# EAGLE design PCB-dol (EAGLE 9.6.2)
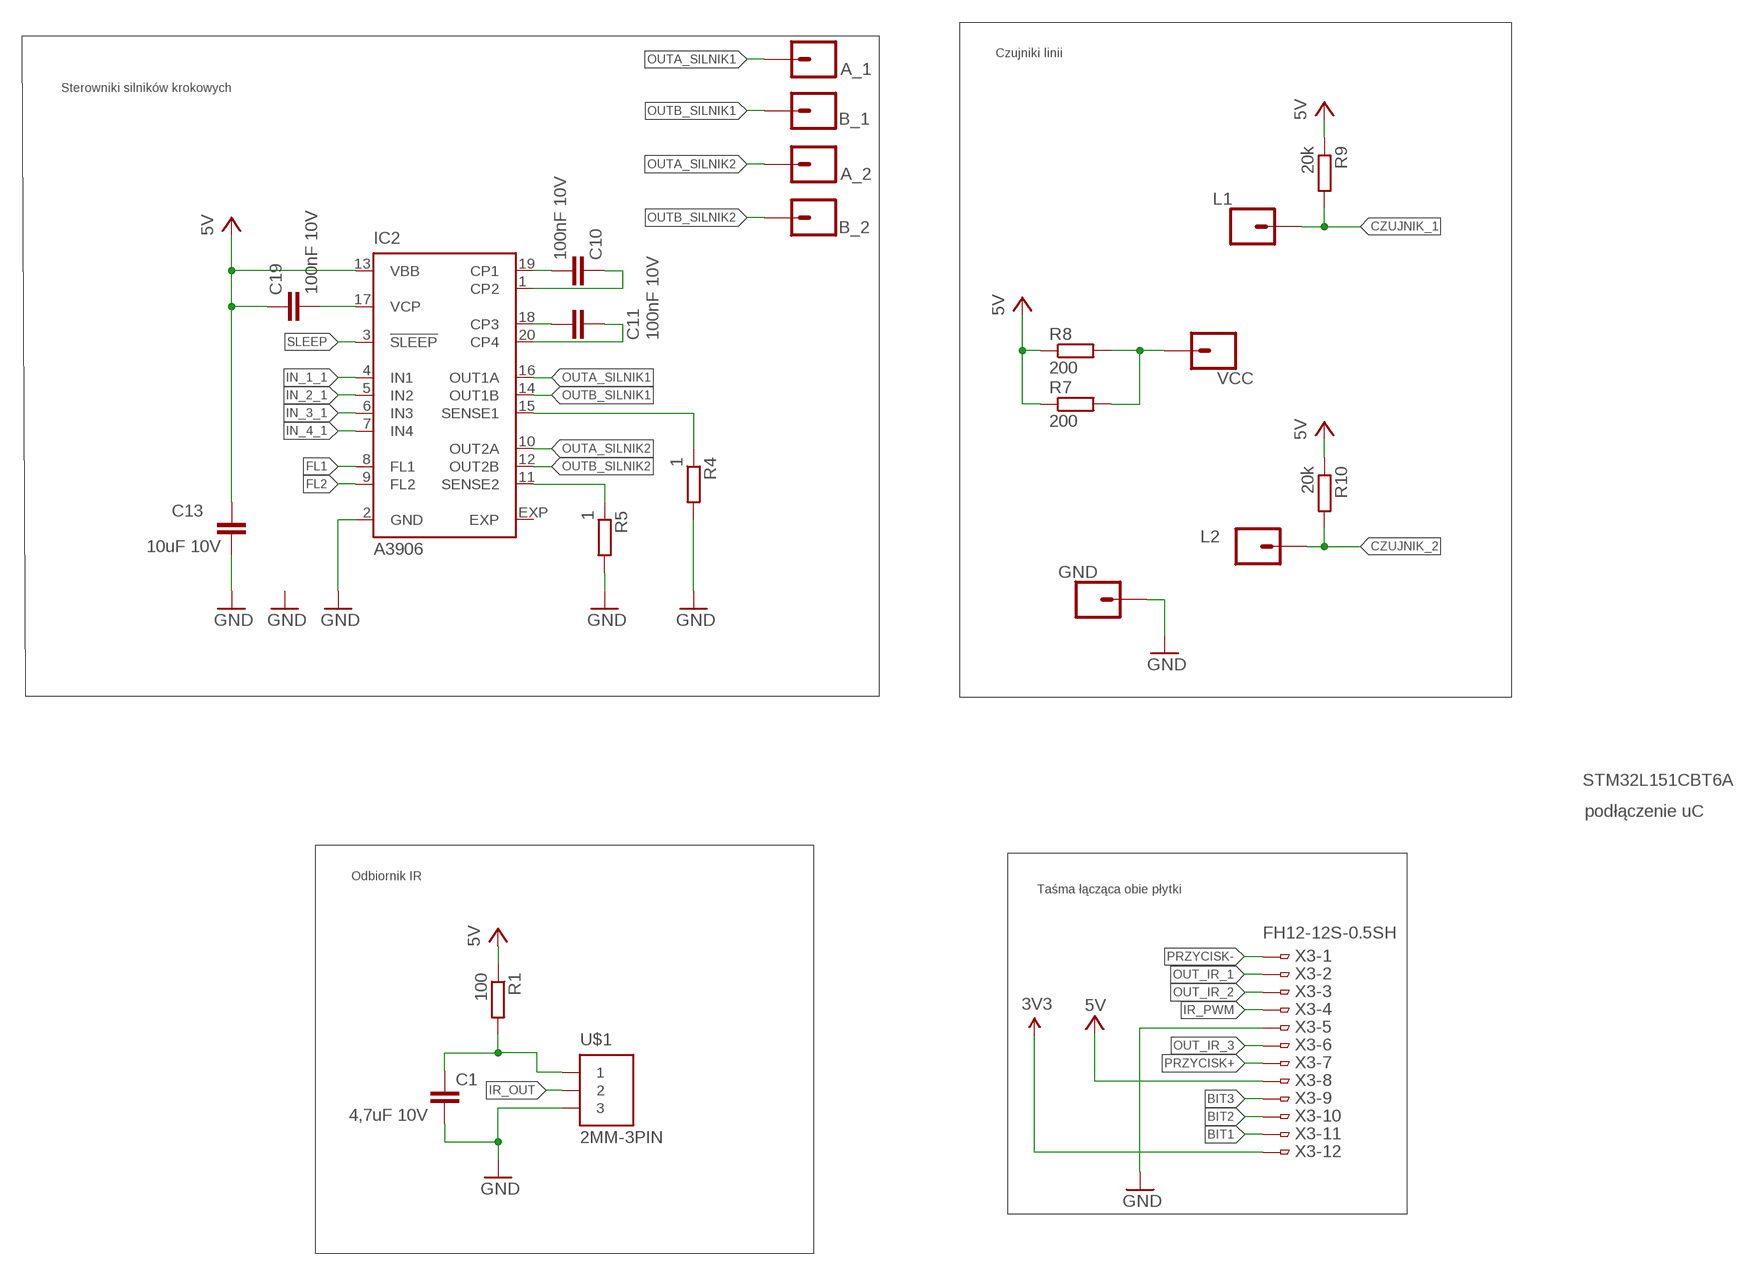
[diagram p0: schematic, sheet 1, part 1 of 2]
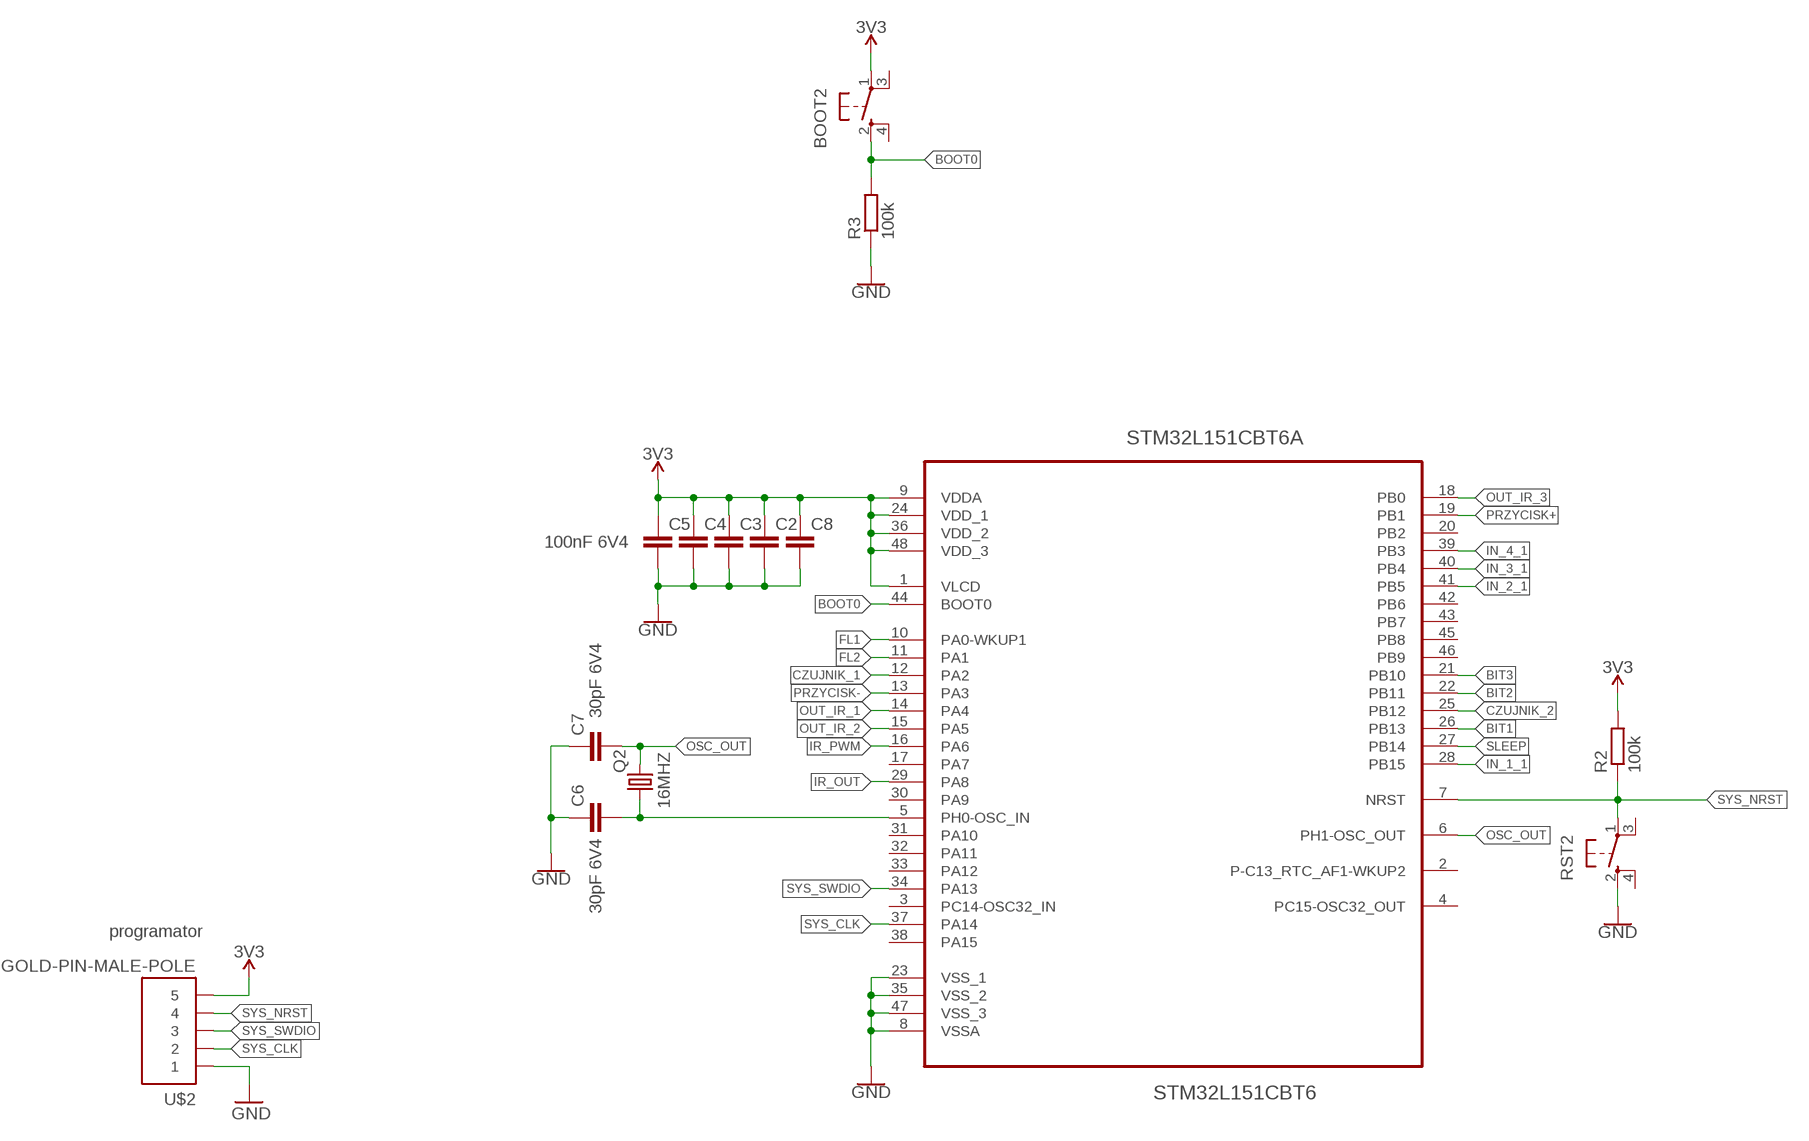
[diagram p1: schematic, sheet 1, part 2 of 2]

## Parts
A_1  CONN_01PTH_NO_SILK_KIT  [1X01NS_KIT]
A_2  CONN_01PTH_NO_SILK_KIT  [1X01NS_KIT]
B_1  CONN_01PTH_NO_SILK_KIT  [1X01NS_KIT]
B_2  CONN_01PTH_NO_SILK_KIT  [1X01NS_KIT]
BOOT2  SPST_TACT-KMR2  [KMR2]
C1  4,7uF 10V  C-EUC0402  [C0402]
C2  100nF 6V4  C-EUC0402  [C0402]
C3  100nF 6V4  C-EUC0402  [C0402]
C4  100nF 6V4  C-EUC0402  [C0402]
C5  100nF 6V4  C-EUC0402  [C0402]
C6  30pF 6V4  C-EUC0402  [C0402]
C7  30pF 6V4  C-EUC0402  [C0402]
C8  100nF 6V4  C-EUC0402  [C0402]
C10  100nF 10V  C-EUC0402  [C0402]
C11  100nF 10V  C-EUC0402  [C0402]
C13  10uF 10V  C-EUC0402  [C0402]
C19  100nF 10V  C-EUC0402  [C0402]
GND  CONN_01PTH_NO_SILK_KIT  [1X01NS_KIT]
IC2  A3906  [QFN20]
L1  CONN_01PTH_NO_SILK_KIT  [1X01NS_KIT]
L2  CONN_01PTH_NO_SILK_KIT  [1X01NS_KIT]
Q2  16MHZ  KX-7  [3.2X2.5_KX-7]
R1  100  R-EU_R0402  [R0402]
R2  100k  R-EU_R0402  [R0402]
R3  100k  R-EU_R0402  [R0402]
R4  1  R-EU_R0402  [R0402]
R5  1  R-EU_R0402  [R0402]
R7  200  R-EU_R0805  [R0805]
R8  200  R-EU_R0805  [R0805]
R9  20k  R-EU_R0402  [R0402]
R10  20k  R-EU_R0402  [R0402]
RST2  SPST_TACT-KMR2  [KMR2]
STM32L151CBT6A  STM32L151CBT6  [QFP50P900X900X160-48N]
U$1  2MM-3PIN  [2MM-3PIN]
U$2  GOLD-PIN-MALE-POLE  [PIN5]
VCC  CONN_01PTH_NO_SILK_KIT  [1X01NS_KIT]
X3  FH12-12S-0.5SH  [FH12-12S-0.5SH]

## Nets
3.3V: BOOT2.1(P) C2.1 C3.1 C4.1 C5.1 C8.1 R2.2 STM32L151CBT6A.1(VLCD) STM32L151CBT6A.9(VDDA) STM32L151CBT6A.24(VDD_1) STM32L151CBT6A.36(VDD_2) STM32L151CBT6A.48(VDD_3) U$2.P$5 X3.12 ; supply symbol labelled 3V3
BIT1: STM32L151CBT6A.26(PB13) X3.11
BIT2: STM32L151CBT6A.22(PB11) X3.10
BIT3: STM32L151CBT6A.21(PB10) X3.9
BOOT0: BOOT2.2(S) R3.2 STM32L151CBT6A.44(BOOT0)
CZUJNIK_1: L1.1 R9.2 STM32L151CBT6A.12(PA2)
CZUJNIK_2: L2.1 R10.2 STM32L151CBT6A.25(PB12)
FL1: IC2.8(FL1) STM32L151CBT6A.10(PA0-WKUP1)
FL2: IC2.9(FL2) STM32L151CBT6A.11(PA1)
GND: C1.2 C2.2 C3.2 C4.2 C5.2 C6.1 C7.1 C8.2 C13.1 GND.1 IC2.2(GND) R3.1 R4.2 R5.2 RST2.2(S) STM32L151CBT6A.8(VSSA) STM32L151CBT6A.23(VSS_1) STM32L151CBT6A.35(VSS_2) STM32L151CBT6A.47(VSS_3) U$1.P$3 U$2.P$1 X3.5
IN_1_1: IC2.4(IN1) STM32L151CBT6A.28(PB15)
IN_2_1: IC2.5(IN2) STM32L151CBT6A.41(PB5)
IN_3_1: IC2.6(IN3) STM32L151CBT6A.40(PB4)
IN_4_1: IC2.7(IN4) STM32L151CBT6A.39(PB3)
IR_OUT: STM32L151CBT6A.29(PA8) U$1.P$2
IR_PWM: STM32L151CBT6A.16(PA6) X3.4
N$1: C6.2 Q2.1 STM32L151CBT6A.5(PH0-OSC_IN)
N$2: C1.1 R1.2 U$1.P$1
N$3: IC2.11(SENSE2) R5.1
N$4: C10.2 IC2.1(CP2)
N$5: C11.2 IC2.20(CP4)
N$6: IC2.15(SENSE1) R4.1
N$12: R7.2 R8.2 VCC.1
N$26: C10.1 IC2.19(CP1)
N$27: C11.1 IC2.18(CP3)
N$32: C19.1 IC2.17(VCP)
OSC_OUT: C7.2 Q2.3 STM32L151CBT6A.6(PH1-OSC_OUT)
OUT_IR_1: STM32L151CBT6A.14(PA4) X3.2
OUT_IR_2: STM32L151CBT6A.15(PA5) X3.3
OUT_IR_3: STM32L151CBT6A.18(PB0) X3.6
OUTA_SILNIK1: A_1.1 IC2.16(OUT1A)
OUTA_SILNIK2: A_2.1 IC2.10(OUT2A)
OUTB_SILNIK1: B_1.1 IC2.14(OUT1B)
OUTB_SILNIK2: B_2.1 IC2.12(OUT2B)
PRZYCISK+: STM32L151CBT6A.19(PB1) X3.7
PRZYCISK-: STM32L151CBT6A.13(PA3) X3.1
SLEEP: IC2.3(!SLEEP) STM32L151CBT6A.27(PB14)
SYS_CLK: STM32L151CBT6A.37(PA14) U$2.P$2
SYS_NRST: R2.1 RST2.1(P) STM32L151CBT6A.7(NRST) U$2.P$4
SYS_SWDIO: STM32L151CBT6A.34(PA13) U$2.P$3
VCC: C13.2 C19.2 IC2.13(VBB) R1.1 R7.1 R8.1 R9.1 R10.1 X3.8 ; supply symbol labelled 5V
Unconnected: BOOT2.3(P1) BOOT2.4(S1) IC2.EXP RST2.3(P1) RST2.4(S1) STM32L151CBT6A.2(P-C13_RTC_AF1-WKUP2) STM32L151CBT6A.3(PC14-OSC32_IN) STM32L151CBT6A.4(PC15-OSC32_OUT) STM32L151CBT6A.17(PA7) STM32L151CBT6A.20(PB2) STM32L151CBT6A.30(PA9) STM32L151CBT6A.31(PA10) STM32L151CBT6A.32(PA11) STM32L151CBT6A.33(PA12) STM32L151CBT6A.38(PA15) STM32L151CBT6A.42(PB6) STM32L151CBT6A.43(PB7) STM32L151CBT6A.45(PB8) STM32L151CBT6A.46(PB9)

## Notes on the sheet
- Czujniki linii
- Sterowniki silników krokowych
- STM32L151CBT6A
- podłączenie uC
- Odbiornik IR
- Taśma łącząca obie płytki
- programator

## Library data of the parts
A_1 A_2 B_1 B_2 GND L1 L2 VCC = SparkFun-Connectors:CONN_01: Single connection point. Often used as Generic Header-pin footprint for 0.1 inch spaced/style header connections On any of the 0.1 inch spaced packages, you can populate with these: Break Away Headers - Straight <https://www.sparkfun.com/products/116> (PRT-00116) Break Away Male Headers - Right Angle <https://www.sparkfun.com/products/553> (PRT-00553) Female Headers <https://www.sparkfun.com/products/115> (PRT-00115) Break Away Headers - Machine Pin <https://www.sparkfun.com/products/117> (PRT-00117) Break Away Female Headers - Swiss Machine Pin <https://www.sparkfun.com/products/743> (PRT-00743) This device is also useful as a general connection point to wire up your design to another part of your project. Our various solder wires solder well into these plated through hole pads. Hook-Up Wire - Assortment (Stranded, 22 AWG) <https://www.sparkfun.com/products/11375> (PRT-11375) Hook-Up Wire - Assortment (Solid Core, 22 AWG) <https://www.sparkfun.com/products/11367> (PRT-11367) View the entire wire category on our website here <https://www.sparkfun.com/categories/141> Special notes: SMTSO-256-ET is a "flush mount" nut for a 4-40 screw. We mostly use this on specialty testbeds; it is a nice way to connect hardware to your PCB at an adjustable hieght. Also note, the SNAP packages are for using a snappable style connector. We sell a baggie of snaps and they are also used on two LilyPad designs: Snap Assortment - 30 pack (male and female) <https://www.sparkfun.com/products/11347> (DEV-11347) LilyPad Arduino SimpleSnap <https://www.sparkfun.com/products/10941> (DEV-10941) LilyPad SimpleSnap Protoboard <https://www.sparkfun.com/products/10940> (DEV-10940)
BOOT2 RST2 = adafruit:SPST_TACT: SMT 6mm switch, EVQQ2 series http://www.ladyada.net/library/eagle
C1-C8 C10 C11 C13 C19 = rcl:C-EU: CAPACITOR, European symbol; SPICEPREFIX: C
IC2 = allegro:A3906: Low Voltage Stepper and Single/Dual DC Motor Driver Data Sheet <http://www.allegromicro.com/en/Products/Part_Numbers/3906/3906.pdf>
Q2 = crystal-geyer_V1_0:KX: Quartz Crystals (MHz) SMD: KX - Serie Model Size l/w/h [mm] Frequency Range Frequency Stability Temp. Range [°C] Load Capacitance AECQ 200 availabel Datasheet KX-4 KX-5 KX-6 KX-7 KX-9A KX-9B KX-12A KX-12B KX-13 KX-20 KX-K KX-KS 1.6/1.2/0.3 2.0/1.6/0.45 2.5/2.0/0.55 3.2/2.5/0.8 5.0/3.2/1.0 5.0/3.2/1.1 6.0/3.5/1.1 6.0/3.5/1.0 7.0/5.0 /1.3 11.6/5.5/1.6 12.3/4.5/4.2 12.3/4.5/3.2 24.0 ~ 80.0 MHz 16.0 ~ 80.0 MHz 12.0 ~ 80.0 MHz 8.0 ~ 60.0 MHz 7,68 ~ 300,0 MHz 8,0 ~ 50,0 MHz 8,0 ~ 150,0 MHz 8,0 ~ 50,0 MHz 6,0 ~ 160,0 MHz 3,579 ~ 25,0 MHz 3,579 ~ 70,0 MHz 3,579 ~ 70,0 MHz ±10 … ±50ppm ±10 … ±50ppm ±10 … ±50ppm ±10 … ±50ppm ±10 … ±50ppm ±10 … ±50ppm ±10 … ±50ppm ±10 … ±50ppm ±10 … ±50ppm ±50ppm ±10 … ±50ppm ±10 … ±50ppm (*) -40°C …+85°C (*) -40°C …+125°C (*) -40°C …+125°C (*) -40°C …+125°C (*) -40°C …+105°C (*) -40°C …+105°C (*) -40°C …+125°C (*) -40°C …+105°C (*) -40°C …+105°C (*) -40°C …+105°C (*) -40°C …+85°C (*) -40°C …+85°C 8, 8…16 8, 8…16 10, 8…16 12, 7…20 16, 10…20 16, 10…20 16, 10…20 16, 12…20 16, 12…20 16, 12…20 16, 12…30 16, 12…30 - yes yes yes - - - - - - - - KX-4.pdf <http://www.geyer-electronic.de/uploads/tx_userartikelfrequenz/GEYER-KX-4.pdf> KX-5.pdf <http://www.geyer-electronic.de/uploads/tx_userartikelfrequenz/GEYER-KX-5.pdf> KX-6.pdf <http://www.geyer-electronic.de/uploads/tx_userartikelfrequenz/GEYER-KX-6.pdf> KX-7.pdf <http://www.geyer-electronic.de/uploads/tx_userartikelfrequenz/GEYER-KX-7.pdf> KX-9A.pdf <http://www.geyer-electronic.de/uploads/tx_userartikelfrequenz/GEYER-KX-9A.pdf> KX-9B.pdf <http://www.geyer-electronic.de/uploads/tx_userartikelfrequenz/GEYER-KX-9B.pdf> KX-12A.pdf <http://www.geyer-electronic.de/uploads/tx_userartikelfrequenz/GEYER-KX-12A.pdf> KX-12B.pdf <http://www.geyer-electronic.de/uploads/tx_userartikelfrequenz/GEYER-KX-12B.pdf> KX-13.pdf <http://www.geyer-electronic.de/uploads/tx_userartikelfrequenz/GEYER-KX-13.pdf> KX-20.pdf <http://www.geyer-electronic.de/uploads/tx_userartikelfrequenz/GEYER-KX-20.pdf> KX-K.pdf <http://www.geyer-electronic.de/uploads/tx_userartikelfrequenz/GEYER-KX-K.pdf> KX-KS.pdf <http://www.geyer-electronic.de/uploads/tx_userartikelfrequenz/GEYER-KX-KS.pdf> <http://www.geyer-electronic.de/fileadmin/template/img/logo-geyer-electronic.png> Details see: http://www.geyer-electronic.de/Frequenz-Produkte.9.0.html Created 2016-06-07, Hans Locher 2016 (C) Geyer Quartz Technology KX4,KX5,KX6,KX7,KX9A,KX9B,KX12A,KX12B,KX13,KX20,KXK,KXKS;1612;2016;2520;3225;5032;6035;7050;11655;12345;1,6x1,2;2,0x1,6;2,5x2,0;3,2x2,5;5,0x3,2;6,0x3,5;7,0x5,0;11,6x5,5;12,3x4,5;12,3x4,5;1.6x1.2;2.0x1.6;2.5x2.0;3.2x2.5;5.0x3.2;6.0x3.5;7.0x5.0;11.6x5.5;12.3x4.5;12.3x4.5;
R1-R5 R7-R10 = rcl:R-EU_: RESISTOR, European symbol; SPICEPREFIX: R
STM32L151CBT6A = ST Microelctronics_By_element14_Batch_1:STM32L151CBT6: ARM-based 32-bit MCU; MPN: STM32L151CBT6; OC_FARNELL: 2060925; OC_NEWARK: 65T3786; PACKAGE: LQFP-48; SUPPLIER: STMICROELECTRONICS
U$1 = 2mm-piny:2MM-3PIN
U$2 = gold-pin-male-pole:GOLD-PIN-MALE-POLE
X3 = con-hirose:FH12-12S-0.5S: 0.5mm Pitch Connectors For FPC/FFC Source: Data sheet <http://www.hirose.co.jp/cataloge_hp/e58605370.pdf>; MPN: FH12-12S-0.5SH(55); OC_FARNELL: 1324542; OC_NEWARK: 34M6155

## Board
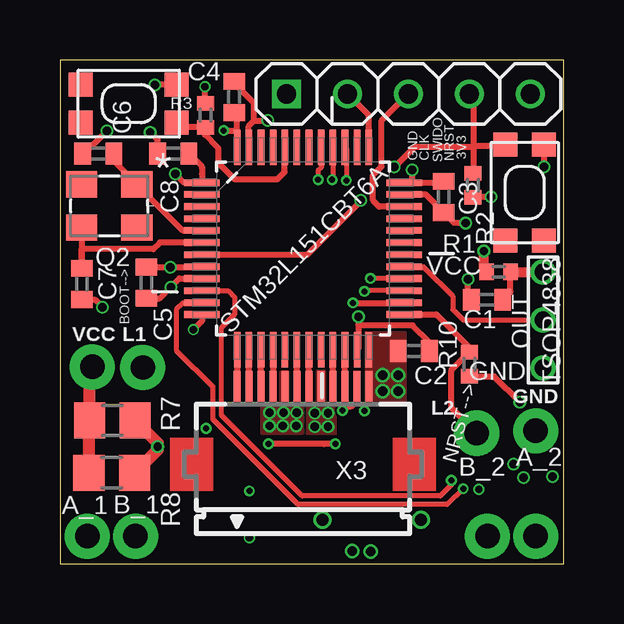
[diagram p2: board, top side]
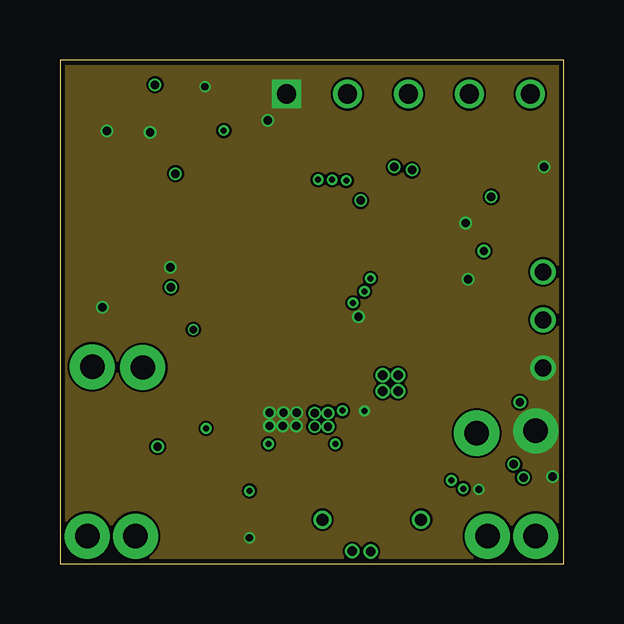
[diagram p3: board, inner layer Route2]
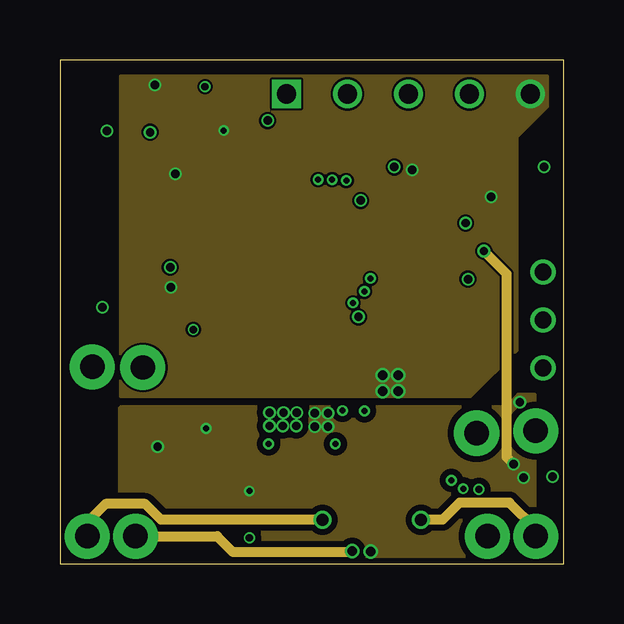
[diagram p4: board, inner layer Route15]
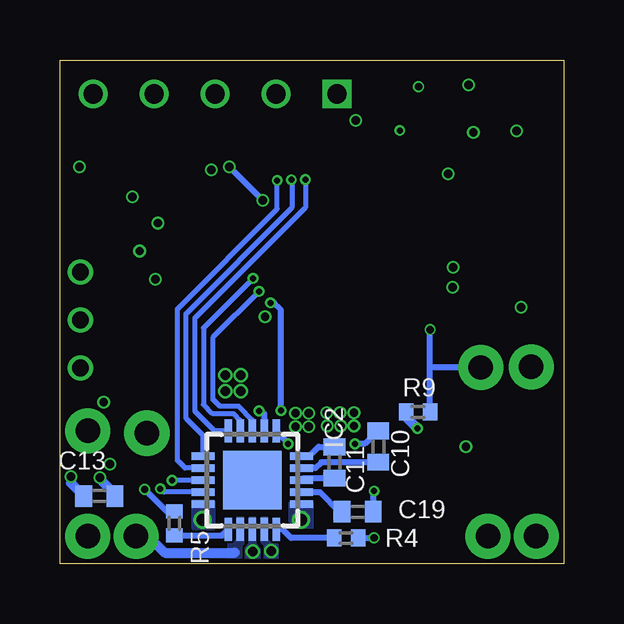
[diagram p5: board, bottom side, seen from below]

Size 21 x 21 mm. Coordinates in mm from the lower left corner, seen from the top.
Outline: 0,0 21,0 21,21 0,21 0,0
Copper layers (1*2+15*16): Top 0.035mm / dielectric 0.5mm / Route2 0.035mm / dielectric 0.46mm / Route15 0.035mm / dielectric 0.5mm / Bottom 0.035mm
Design rules "JLC4L": minimum track width 3.5mil, minimum drill 0.2mm, track to track 3.5mil, track to pad 5mil, pad to pad 5mil, via to via 5mil, smd to smd 5mil, copper to edge 0.2mm, drill to drill 5mil, minimum pad ring 3mil, minimum via ring 3mil, stop-mask expansion 2mil, vias tented up to drill 0.6mm, thermal gap 5mil

### Footprints (pad centres in the part's own frame; a part is rotated, then mirrored left to right if it is on the bottom)
1X01NS_KIT = drill 1.016 pad 1.88: 1 0,0
KMR2 = smd 1 x 1: 1 2,0.8; 2 2,-0.8; 3 -2,0.8; 4 -2,-0.8
C0402 = smd 0.7 x 0.9: 1 -0.65,0; 2 0.65,0
QFN20 = smd 0.95 x 0.3: 1 -2.05,1; 2 -2.05,0.5; 3 -2.05,0; 4 -2.05,-0.5; 5 -2.05,-1; 11 2.05,-1; 12 2.05,-0.5; 13 2.05,0; 14 2.05,0.5; 15 2.05,1 | smd 0.3 x 0.95: 6 -1,-2.05; 7 -0.5,-2.05; 8 0,-2.05; 9 0.5,-2.05; 10 1,-2.05; 16 1,2.05; 17 0.5,2.05; 18 0,2.05; 19 -0.5,2.05; 20 -1,2.05 | smd 2.45 x 2.45: EXP 0,0
3.2X2.5_KX-7 = smd 1.3 x 1.1: 1 -1.15,-0.9; 2 1.15,-0.9; 3 1.15,0.9; 4 -1.15,0.9
R0402 = smd 0.6 x 0.7: 1 -0.5,0; 2 0.5,0
R0805 = smd 1.3 x 1.5: 1 -0.95,0; 2 0.95,0
QFP50P900X900X160-48N = smd 1.473 x 0.279: 1 -4.216,2.743; 2 -4.216,2.261; 3 -4.216,1.753; 4 -4.216,1.245; 5 -4.216,0.762; 6 -4.216,0.254; 7 -4.216,-0.254; 8 -4.216,-0.762; 9 -4.216,-1.245; 10 -4.216,-1.753; 11 -4.216,-2.261; 12 -4.216,-2.743; 25 4.216,-2.743; 26 4.216,-2.261; 27 4.216,-1.753; 28 4.216,-1.245; 29 4.216,-0.762; 30 4.216,-0.254; 31 4.216,0.254; 32 4.216,0.762; 33 4.216,1.245; 34 4.216,1.753; 35 4.216,2.261; 36 4.216,2.743 | smd 0.279 x 1.473: 13 -2.743,-4.216; 14 -2.261,-4.216; 15 -1.753,-4.216; 16 -1.245,-4.216; 17 -0.762,-4.216; 18 -0.254,-4.216; 19 0.254,-4.216; 20 0.762,-4.216; 21 1.245,-4.216; 22 1.753,-4.216; 23 2.261,-4.216; 24 2.743,-4.216; 37 2.743,4.216; 38 2.261,4.216; 39 1.753,4.216; 40 1.245,4.216; 41 0.762,4.216; 42 0.254,4.216; 43 -0.254,4.216; 44 -0.762,4.216; 45 -1.245,4.216; 46 -1.753,4.216; 47 -2.261,4.216; 48 -2.743,4.216
2MM-3PIN = drill 0.7: P$1 0,2; P$2 0,0; P$3 0,-2
PIN5 = drill 0.8 square: P$1 0,5.08 | drill 0.8: P$2 0,2.54; P$3 0,0; P$4 0,-2.54; P$5 0,-5.08
FH12-12S-0.5SH = smd 0.3 x 1.3: 1 -2.75,3.25; 2 -2.25,3.25; 3 -1.75,3.25; 4 -1.25,3.25; 5 -0.75,3.25; 6 -0.25,3.25; 7 0.25,3.25; 8 0.75,3.25; 9 1.25,3.25; 10 1.75,3.25; 11 2.25,3.25; 12 2.75,3.25

### Placement (x,y rotation side)
A_1  1.14,1.14 0 top
A_2  19.84,1.14 0 top
B_1  3.15,1.14 0 top
B_2  17.83,1.14 0 top
BOOT2  2.87,19.18 0 top
C1  17.81,11 180 top
C2  14.76,8.86 0 top
C3  16,15.29 270 top
C4  7.26,19.46 90 top
C5  3.61,11.71 90 top
C6  1.6,17.09 0 top
C7  0.91,11.66 90 top
C8  4.72,17.09 180 top
C10  7.72,4.88 90 bottom
C11  9.55,4.22 90 bottom
C13  19.35,2.82 0 bottom
C19  8.59,2.16 0 bottom
GND  19.84,5.54 0 top
IC2  12.98,3.48 270 bottom
L1  3.45,8.18 0 top
L2  17.37,5.44 0 top
Q2  2.06,14.91 180 top
R1  18.29,12.17 0 top
R2  17.22,15.77 270 top
R3  6.07,18.69 270 top
R4  9.07,1.07 0 bottom
R5  16.23,1.68 90 bottom
R7  2.18,5.97 180 top
R8  2.16,3.78 180 top
R9  6.07,6.32 0 bottom
R10  17.07,8.31 90 top
RST2  19.38,15.47 90 top
STM32L151CBT6A  10.13,13.13 0 top
U$1  20.14,10.16 0 top
U$2  14.53,19.58 90 top
VCC  1.35,8.2 0 top
X3  10.13,4.14 0 top

### Tracks (layer width: path | path; a pad name or v marks a point on that pad's centre or on a via)
3.3V  (via drill 0.25 pad 0.45, 0.35 pad 0.45, 0.4 pad 0.45)
  Top 0.254: C3.1 15.94,15.88 14.66,15.88 | 14.66,15.88 STM32L151CBT6A.36 | STM32L151CBT6A.48 7.39,17.91 7.39,18.03 | 7.39,18.03 7.39,18.64 C4.1 | C8.1 5.92,16.55 5.92,16.51 5.92,16.26 STM32L151CBT6A.1 5.2,15.88 v4.82,16.26 | BOOT2.1 3.98,19.98 v3.96,19.96 | v17.98,15.29 17.97,15.27 R2.2 | v14.68,16.41 14.68,15.9 14.66,15.88 | C5.1 4.16,11.06 v4.62,11.52 4.99,11.89 STM32L151CBT6A.9 | v6.83,18.06 7.37,18.06 7.39,18.03
  other vias: 13.46,7.85 14.1,7.85 13.46,7.19 14.1,7.19
  pour Top (no thermals): 12.75,9.63 14.4,9.63 14.4,6.81 12.75,6.81
  pour Route15 (no thermals): 17.12,6.96 19.05,8.89 19.05,17.78 20.32,19.05 20.32,20.32 2.54,20.32 2.54,6.96
BIT1  (via drill 0.25 pad 0.45)
  Top 0.203: v11.79,6.38 11.92,6.51 12.13,6.51 12.38,6.77 X3.11
  Top 0.254: v12.22,10.87 STM32L151CBT6A.26
  Bottom 0.254: v11.79,6.38 11.79,10.59 12.06,10.87 v12.22,10.87
BIT2
  Top 0.254: STM32L151CBT6A.22 11.87,8.89 X3.10
BIT3
  Top 0.254: X3.9 11.37,8.9 STM32L151CBT6A.21
BOOT0
  Top 0.254: STM32L151CBT6A.44 9.37,16.33 9.07,16.03 7.29,16.03 6.6,16.71 6.6,17.32 6.04,17.88 6.04,18.17 R3.2 5.05,18.19 BOOT2.2
CZUJNIK_1  (via drill 0.3 pad 0.45)
  Top 0.254: STM32L151CBT6A.12 5.92,10.11 v5.56,9.75
  Bottom 0.254: R9.2 5.57,8.18 | 5.57,8.18 v5.57,9.75 v5.56,9.75 | L1.1 5.57,8.18
CZUJNIK_2
  Top 0.254: STM32L151CBT6A.25 15.7,10.39 17.07,9.02 R10.2 16.31,8.05 16.31,6.5 L2.1
FL1  (via drill 0.25 pad 0.45)
  Top 0.203: v16.32,3.47 16.32,3.28 15.86,2.82 10.1,2.82 6.74,6.18 6.74,9.84 7.29,10.39 7.29,11.1 7.01,11.38 STM32L151CBT6A.10
  Bottom 0.203: v16.32,3.47 16.31,3.48 IC2.8
FL2  (via drill 0.25 pad 0.45)
  Top 0.203: v16.82,3.12 16.15,2.46 9.93,2.46 6.38,6.02 6.38,7.37 4.85,8.89 4.85,10.59 5.13,10.87 STM32L151CBT6A.11
  Bottom 0.203: IC2.9 16.67,2.98 v16.82,3.12
GND  (via drill 0.25 pad 0.45, 0.3 pad 0.45, 0.35 pad 0.45)
  Top 0.254: STM32L151CBT6A.35 15.25,15.39 C3.2 16.44,14.2 v16.92,14.2 | C4.2 7.26,20.04 7.27,20.04 8.1,19.2 8.1,18.47 | v1.96,18.03 1.02,17.09 C6.1 | C7.1 1.46,11.01 v1.78,10.69 | C8.2 4.07,17.67 v3.76,17.98 | C2.2 15.41,9.23 14.71,9.93 12.45,9.93 | RST2.2 v20.18,16.55 v20.19,16.54 | C1.2 17.02,11.14 v17.02,11.86 | STM32L151CBT6A.8 5.9,12.35 v4.6,12.35 C5.2 | v12.45,10.29 12.45,9.93 | 12.45,9.93 12.45,9.42 12.45,8.97 STM32L151CBT6A.23 | R3.1 6.04,19.22 v6.04,19.89 | STM32L151CBT6A.47 7.87,18.24 8.1,18.47 | 8.1,18.47 8.11,18.47 v8.66,18.47
  Bottom 0.254: v17.47,3.1 16.55,2.18 R5.2 | R4.2 v7.9,1.07 | IC2.2 12.48,6.25 12.65,6.42 v12.7,6.37
  Bottom 0.406: C13.1 20.54,3.35 v20.54,3.63
  other vias: 9.32,6.3 8.74,6.3 9.88,6.3 8.74,5.74 9.3,5.74 9.86,5.74
  pour Top (no thermals): 9.22,8 9.5,8 9.5,6.73 9.7,6.53 10.11,6.53 10.11,5.41 8.43,5.41 8.43,6.55 9.02,6.55 9.22,6.76
  pour Route2 (no thermals): 0,21.59 21.59,21.59 21.59,0 0,0
IN_1_1  (via drill 0.25 pad 0.45)
  Top 0.203: STM32L151CBT6A.28 v12.95,11.89
  Bottom 0.203: IC2.4 13.48,5.98 13.75,6.25 14.63,6.25 15.01,6.63 15.01,9.83 v12.95,11.89
IN_2_1  (via drill 0.25 pad 0.45)
  Top 0.203: STM32L151CBT6A.41 10.9,16.51 10.77,16.39 v10.77,16
  Bottom 0.203: IC2.5 14.55,5.53 15.37,6.35 15.37,10.24 10.77,14.83 v10.77,16
IN_3_1  (via drill 0.25 pad 0.45)
  Top 0.203: STM32L151CBT6A.40 11.38,16.03 v11.35,16
  Bottom 0.203: IC2.6 15.03,5.34 15.75,6.06 15.75,10.41 11.33,14.83 11.33,15.98 v11.35,16
IN_4_1  (via drill 0.25 pad 0.45)
  Top 0.203: STM32L151CBT6A.39 11.94,17.3 v11.94,15.98
  Bottom 0.203: IC2.7 15.79,3.98 16.1,4.29 16.1,10.62 11.94,14.78 v11.94,15.98
IR_OUT
  Top 0.203: STM32L151CBT6A.29 15.16,12.37 16.38,11.15 16.38,10.59 16.82,10.16 U$1.P$2
IR_PWM
  Top 0.254: STM32L151CBT6A.16 X3.4
N$1
  Top 0.254: STM32L151CBT6A.5 5.12,13.89 Q2.1 2.25,16.77 | 2.25,16.77 C6.2 2.25,16.77
N$2
  Top 0.254: C1.1 18.79,11.33 R1.2
  Top 0.406: R1.2 U$1.P$1
N$3
  Bottom 0.254: R5.1 14.23,1.18 IC2.11
N$4  (via drill 0.25 pad 0.45)
  Top 0.254: v8.69,4.99 8.74,4.99 11.02,4.99 v11.47,4.99 v11.48,4.99
  Bottom 0.254: C10.2 7.75,5.53 8.26,5.01 8.69,5.01 v8.69,4.99 | IC2.1 11.48,5.03 v11.48,4.99
N$5
  Bottom 0.254: IC2.20 10.6,4.48 10.21,4.87 C11.2
N$6
  Bottom 0.254: R4.1 11.36,1.07 11.72,1.43 IC2.15
N$12
  Top 0.508: R8.2 1.21,5.94 R7.2 1.23,8.09 VCC.1
N$26
  Bottom 0.254: IC2.19 10.35,3.98 10.1,4.23 C10.1
N$27
  Bottom 0.254: IC2.18 10.84,3.57 C11.1
N$32
  Bottom 0.254: IC2.17 10.16,2.98 9.34,2.16 C19.1
OSC_OUT
  Top 0.254: STM32L151CBT6A.6 4.17,13.39 3.89,13.11 0.93,13.11 0.91,13.13 | Q2.3 0.91,12.54 0.91,13.13 | 0.91,13.13 C7.2
OUT_IR_1
  Top 0.254: STM32L151CBT6A.14 7.87,8.91 X3.2
OUT_IR_2
  Top 0.254: X3.3 8.37,8.9 STM32L151CBT6A.15
OUT_IR_3
  Top 0.254: STM32L151CBT6A.18 9.87,8.9 X3.6
OUTA_SILNIK1  (via drill 0.5 pad 0.45)
  Route15 0.406: v10.95,1.83 4.22,1.83 3.56,2.49 1.91,2.49 1.14,1.73 A_1.1
  pour Bottom (isolate 0.254, no thermals): 10.49,2.59 11.4,2.59 11.4,1.35 10.49,1.35
OUTA_SILNIK2  (via drill 0.5 pad 0.45)
  Route15 0.406: A_2.1 19.84,1.45 18.75,2.54 16.66,2.54 15.95,1.83 v15.06,1.83
  pour Bottom (no thermals): 14.58,2.59 15.47,2.59 15.47,1.47 14.58,1.47
OUTB_SILNIK1  (via drill 0.4 pad 0.45)
  Route15 0.406: B_1.1 6.55,1.14 7.22,0.47 12.15,0.47 v12.19,0.51
  pour Bottom (no thermals): 12.34,1.91 12.62,1.91 12.62,0.91 12.47,0.76 12.47,0.15 11.91,0.15 11.91,0.79 12.14,0.79 12.34,0.99
OUTB_SILNIK2
  Bottom 0.406: B_2.1 17.31,1.14 16.63,0.46 13.72,0.46
  pour Bottom (no thermals): 13.34,1.91 13.64,1.91 13.64,0.99 13.82,0.81 14,0.81 14,0.25 13.44,0.25 13.44,0.74 13.34,0.84
PRZYCISK+
  Top 0.254: X3.7 10.37,8.89 STM32L151CBT6A.19
PRZYCISK-
  Top 0.254: X3.1 STM32L151CBT6A.13
SLEEP  (via drill 0.25 pad 0.45)
  Top 0.203: STM32L151CBT6A.27 12.72,11.38 v12.7,11.35
  Bottom 0.203: IC2.3 12.98,5.99 13.54,6.55 14.33,6.55 14.63,6.86 14.63,9.42 v12.7,11.35
SYS_CLK
  Top 0.254: U$2.P$2 12.88,18.69 STM32L151CBT6A.37
SYS_NRST  (via drill 0.35 pad 0.45)
  Top 0.254: 10.31,12.88 10.4,12.97 | 10.4,12.97 12.55,15.11 v12.55,15.13 v12.54,15.14 | v13.95,16.54 14.78,17.37 17.2,17.37 17.22,17.4 17.25,17.4 | RST2.1 18.51,17.4 17.25,17.4 | R2.1 17.25,16.3 17.25,17.4 | STM32L151CBT6A.7 10.31,12.88 | 10.31,12.88 10.4,12.97 | U$2.P$4 17.25,19.41 17.25,17.4
  Bottom 0.254: v13.95,16.54 v13.94,16.54 v12.54,15.14
SYS_SWDIO
  Top 0.254: STM32L151CBT6A.34 13.31,14.88 13.06,15.14 13.06,16.2 13.41,16.56 13.41,18.47 U$2.P$3
VCC  (via drill 0.25 pad 0.45, 0.35 pad 0.45, 0.4 pad 0.45)
  Top 0.254: v19.18,6.73 18.1,7.81 R10.1
  Top 0.406: R1.1 17.68,12.28 v17.68,13.03
  Top 0.508: R8.1 4.07,4.75 v4.07,4.88 4.07,5.03 R7.1
  Route15 0.406: v17.68,13.03 18.62,12.09 18.62,4.45 v18.92,4.14
  Bottom 0.254: C19.2 7.93,2.99 v7.9,3.02
  Bottom 0.406: R9.1 6.57,6.11 v6.1,5.64 | C13.2 18.7,2.9 19.36,3.55 v19.33,3.58
  other vias: 10.62,6.27 11.18,6.27 10.62,5.71 11.18,5.71 12.95,0.51
  pour Top (no thermals): 10.72,8.03 11.05,8.03 11.05,6.68 11.15,6.58 11.48,6.58 11.48,5.41 10.31,5.41 10.31,6.58 10.59,6.58 10.72,6.71
  pour Bottom (no thermals): 12.85,1.91 13.11,1.91 13.11,0.81 13.26,0.66 13.26,0.15 12.65,0.15 12.65,0.61 12.85,0.81
  pour Route15 (isolate 0.254, no thermals): 2.54,6.5 18.59,6.5 19.13,7.04 19.76,7.04 19.76,0.18 2.54,0.18

### Text on the board
tNames: 3V3 | GND | CLK | SWIDO | NRST | VCC | BOOT--> | OUT | GND | TSOP4838 | NRST-->